# Altium project USB3-PCIEv21.PRJPCB
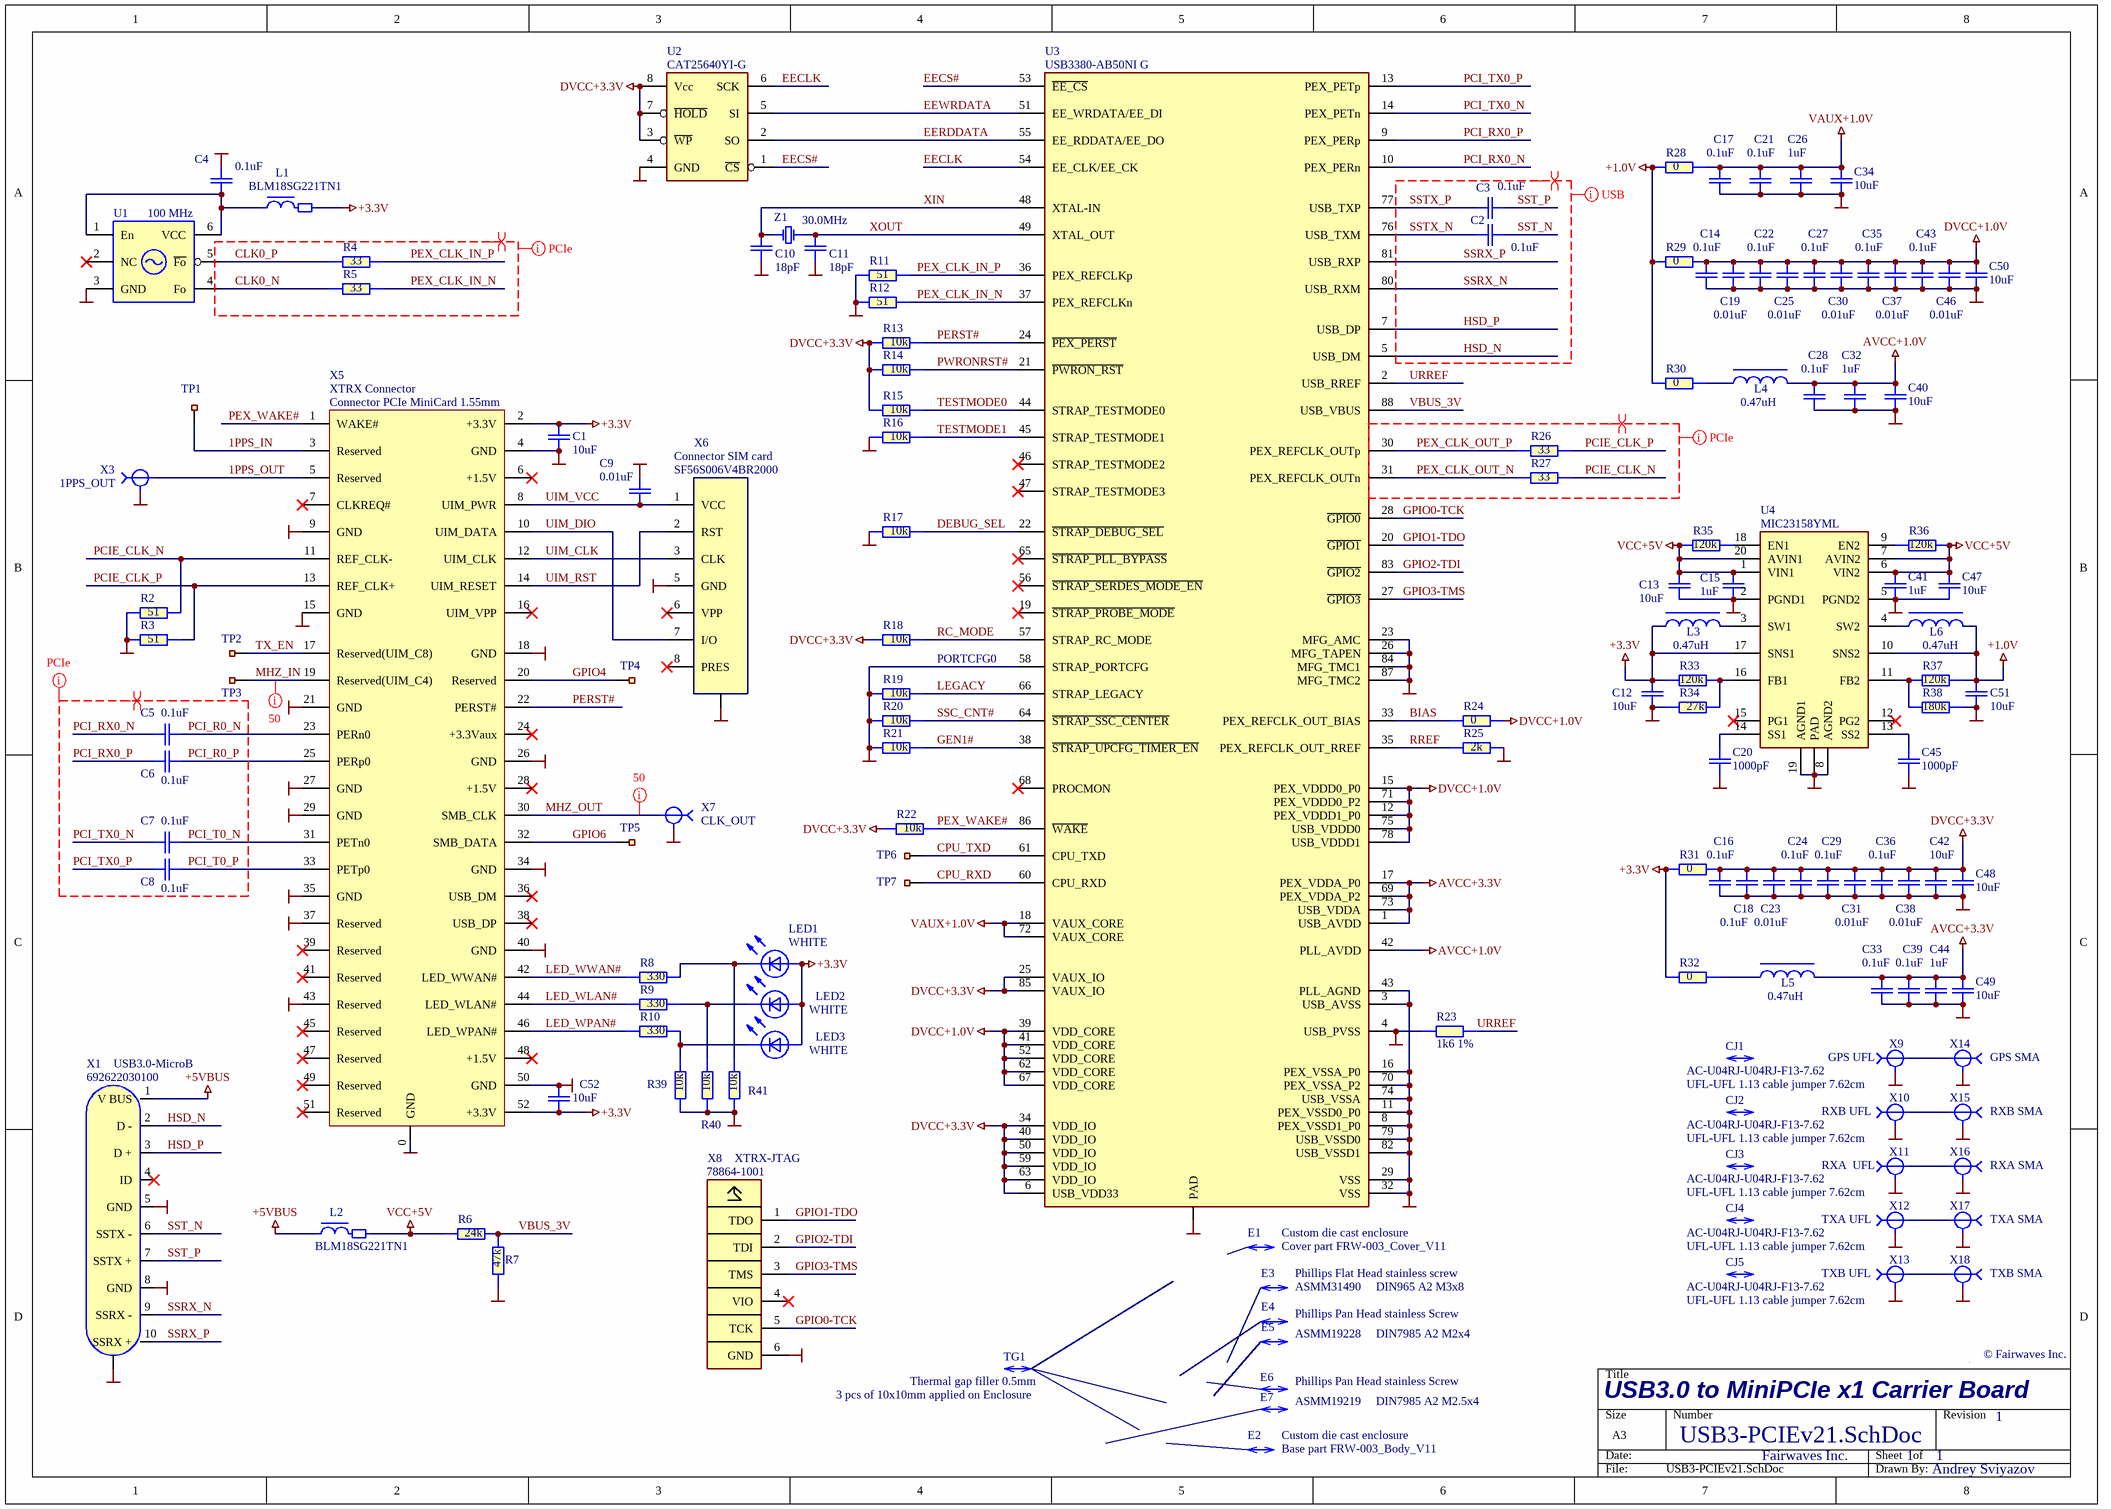
[diagram p0: USB3-PCIEv21.SchDoc]
1 sheet, 143 parts. Net scope: hierarchical (ports join the sheet entries above them; power ports are global).
Board file: USB3-PCIEv21.PcbDoc

## Sheet USB3-PCIEv21.SchDoc: USB3.0 to MiniPCIe x1 Carrier Board
size A3; CompanyName: Fairwaves Inc.; DrawnBy: Andrey Sviyazov; Revision: 1; SheetNumber: 1; SheetTotal: 1; PageSetup: Record=PageOptions|CenterHorizontal=True|CenterVertical=True|PrintScale=1.04|XCorrection=1.00|YCorrection=1.00|PrintKind=0|BorderSize=5000000|LeftOffset=0|BottomOffset=0|Orientation=2|PaperLength=1000|PaperWidth=1000|Scale=100|PaperSource=7|PrintQuality=-3|MediaType=1|DitherType=10|PrintScaleMode=1|PaperKind=A3|PaperIndex=8

### Parts
C1  10uF  [C0402-Phillips]
C2  0.1uF  [C0402-Phillips]
C3  0.1uF  [C0402-Phillips]
C4  0.1uF  [C0402-Phillips]
C5  0.1uF  [C0402-Phillips]
C6  0.1uF  [C0402-Phillips]
C7  0.1uF  [C0402-Phillips]
C8  0.1uF  [C0402-Phillips]
C9  0.01uF  [C0402-Phillips]
C10  18pF  [C0402-Phillips]
C11  18pF  [C0402-Phillips]
C12  10uF  [C0402-Phillips]
C13  10uF  [C0402-Phillips]
C14  0.1uF  [C0402-Phillips]
C15  1uF  [C0402-Phillips]
C16  0.1uF  [C0402-Phillips]
C17  0.1uF  [C0402-Phillips]
C18  0.1uF  [C0402-Phillips]
C19  0.01uF  [C0402-Phillips]
C20  1000pF  [C0402-Phillips]
C21  0.1uF  [C0402-Phillips]
C22  0.1uF  [C0402-Phillips]
C23  0.01uF  [C0402-Phillips]
C24  0.1uF  [C0402-Phillips]
C25  0.01uF  [C0402-Phillips]
C26  1uF  [C0402-Phillips]
C27  0.1uF  [C0402-Phillips]
C28  0.1uF  [C0402-Phillips]
C29  0.1uF  [C0402-Phillips]
C30  0.01uF  [C0402-Phillips]
C31  0.01uF  [C0402-Phillips]
C32  1uF  [C0402-Phillips]
C33  0.1uF  [C0402-Phillips]
C34  10uF  [C0402-Phillips]
C35  0.1uF  [C0402-Phillips]
C36  0.1uF  [C0402-Phillips]
C37  0.01uF  [C0402-Phillips]
C38  0.01uF  [C0402-Phillips]
C39  0.1uF  [C0402-Phillips]
C40  10uF  [C0402-Phillips]
C41  1uF  [C0402-Phillips]
C42  10uF  [C0402-Phillips]
C43  0.1uF  [C0402-Phillips]
C44  1uF  [C0402-Phillips]
C45  1000pF  [C0402-Phillips]
C46  0.01uF  [C0402-Phillips]
C47  10uF  [C0402-Phillips]
C48  10uF  [C0402-Phillips]
C49  10uF  [C0402-Phillips]
C50  10uF  [C0402-Phillips]
C51  10uF  [C0402-Phillips]
C52  10uF  [C0402-Phillips]
CJ1  AC-U04RJ-U04RJ-F13-7.62  Misc: UFL-UFL 1.13 cable jumper 7.62cm  (mechanical)
CJ2  AC-U04RJ-U04RJ-F13-7.62  Misc: UFL-UFL 1.13 cable jumper 7.62cm  (mechanical)
CJ3  AC-U04RJ-U04RJ-F13-7.62  Misc: UFL-UFL 1.13 cable jumper 7.62cm  (mechanical)
CJ4  AC-U04RJ-U04RJ-F13-7.62  Misc: UFL-UFL 1.13 cable jumper 7.62cm  (mechanical)
CJ5  AC-U04RJ-U04RJ-F13-7.62  Misc: UFL-UFL 1.13 cable jumper 7.62cm  (mechanical)
E1  Cover part FRW-003_Cover_V11  (mechanical)
E2  Base part FRW-003_Body_V11  (mechanical)
E3  DIN965 A2 M3x8  value ASMM31490  Misc: Phillips Flat Head stainless screw  (mechanical)
E4  DIN7985 A2 M2x4  value ASMM19228  Misc: Phillips Pan Head stainless Screw  (mechanical)
E5  DIN7985 A2 M2x4  (value not drawn)  (mechanical)
E6  DIN7985 A2 M2.5x4  value ASMM19219  Misc: Phillips Pan Head stainless Screw  (mechanical)
E7  DIN7985 A2 M2.5x4  (value not drawn)  (mechanical)
L1  BLM18SG221TN1  [TI160808-Phillips]
L2  BLM18SG221TN1  [TI160808-Phillips]
L3  0.47uH  [L-VLS201610HBX]
L4  0.47uH  [L-VLS201610HBX]
L5  0.47uH  [L-VLS201610HBX]
L6  0.47uH  [L-VLS201610HBX]
LED1  WHITE  [LED-0603YL]
LED2  WHITE  [LED-0603YL]
LED3  WHITE  [LED-0603YL]
LOGO1  © Fairwaves Inc.  [Logo Fairwaves]  (no BOM)
R2  51  [R0402-Phillips]
R3  51  [R0402-Phillips]
R4  33  [R0402-Phillips]
R5  33  [R0402-Phillips]
R6  24k  [R0402-Phillips]
R7  47k  [R0402-Phillips]
R8  330  [R0402-Phillips]
R9  330  [R0402-Phillips]
R10  330  [R0402-Phillips]
R11  51  [R0402-Phillips]
R12  51  [R0402-Phillips]
R13  10k  [R0402-Phillips]
R14  10k  [R0402-Phillips]
R15  10k  [R0402-Phillips]
R16  10k  [R0402-Phillips]
R17  10k  [R0402-Phillips]
R18  10k  [R0402-Phillips]
R19  10k  [R0402-Phillips]
R20  10k  [R0402-Phillips]
R21  10k  [R0402-Phillips]
R22  10k  [R0402-Phillips]
R23  1k6 1%  [R0402-Phillips]
R24  0  [R0402-Phillips]
R25  2k  [R0402-Phillips]
R26  33  [R0402-Phillips]
R27  33  [R0402-Phillips]
R28  0  [R0402-Phillips]
R29  0  [R0402-Phillips]
R30  0  [R0402-Phillips]
R31  0  [R0402-Phillips]
R32  0  [R0402-Phillips]
R33  120k  [R0402-Phillips]
R34  27k  [R0402-Phillips]
R35  120k  [R0402-Phillips]
R36  120k  [R0402-Phillips]
R37  120k  [R0402-Phillips]
R38  180k  [R0402-Phillips]
R39  10k  [R0402-Phillips]
R40  10k  [R0402-Phillips]
R41  10k  [R0402-Phillips]
TG1  3 pcs of 10x10mm applied on Enclosure  Misc: Thermal gap filler 0.5mm  (mechanical)
TP1  (no value)  [KP-C_d1mm]  (no BOM)
TP2  (no value)  [KP-C_d1mm]  (no BOM)
TP3  (no value)  [KP-C_d1mm]  (no BOM)
TP4  (no value)  [KP-C_d1mm]  (no BOM)
TP5  (no value)  [KP-C_d1mm]  (no BOM)
TP6  (no value)  [KP-C_d1mm]  (no BOM)
TP7  (no value)  [KP-C_d1mm]  (no BOM)
U1  100 MHz  [XO5X3.2-6pin]
U2  CAT25640YI-G  [TSSOP-8]
U3  USB3380-AB50NI G  [QFN-88(10x10/0.4mm)_pad]
U4  MIC23158YML  [MLF-20(3X4/0.5)MIC]
X1  692622030100  [USB3.0-MicroB SMT]
X3  Misc: 1PPS_OUT  [U_FL]  (hidden comment: 0734120110)
X5  Connector PCIe MiniCard 1.55mm  value XTRX Connector  [PCIe MiniCard 1.55mm conn]
X6  Connector SIM card  Name: SF56S006V4BR2000  [SIM_SF56S006V4BR2000-dig]
X7  Misc: CLK_OUT  [U_FL]  (hidden comment: 0734120110)
X8  XTRX-JTAG  Name: 78864-1001  [Molex 78864-1001]
X9  Misc: GPS UFL  [U_FL]  (hidden comment: 0734120110)
X10  Misc: RXB UFL  [U_FL]  (hidden comment: 0734120110)
X11  Misc: RXA  UFL  [U_FL]  (hidden comment: 0734120110)
X12  Misc: TXA UFL  [U_FL]  (hidden comment: 0734120110)
X13  Misc: TXB UFL  [U_FL]  (hidden comment: 0734120110)
X14  Misc: GPS SMA  [SMA - edge]  (hidden comment: SMA edge SMD mount)
X15  Misc: RXB SMA  [SMA - edge]  (hidden comment: SMA edge SMD mount)
X16  Misc: RXA SMA  [SMA - edge]  (hidden comment: SMA edge SMD mount)
X17  Misc: TXA SMA  [SMA - edge]  (hidden comment: SMA edge SMD mount)
X18  Misc: TXB SMA  [SMA - edge]  (hidden comment: SMA edge SMD mount)
Z1  30.0MHz  [ZQ_SMD2532]

### Nets
+1.0V: C51.2 L6.2 R28.2 R29.2 R30.2 R37.1 U4.10(SNS2)
+3.3V: C1.2 C12.2 C52.1 L1.2 L3.1 LED1.2(A) LED2.2(A) LED3.2(A) R31.2 R32.2 R33.2 U4.17(SNS1) X5.2(+3.3V) X5.52(+3.3V)
+5VBUS: L2.1 X1.1(V_BUS)
AVCC+1.0V: C28.1 C32.2 C40.2 L4.2 U3.42(PLL_AVDD)
AVCC+3.3V: C33.1 C39.1 C44.2 C49.2 L5.2 U3.1(USB_AVDD) U3.17(PEX_VDDA_P0) U3.69(PEX_VDDA_P2) U3.73(USB_VDDA)
DVCC+1.0V: C14.1 C19.2 C22.1 C25.2 C27.1 C30.2 C35.1 C37.2 C43.1 C46.2 C50.2 R24.1 R29.1 U3.12(PEX_VDDD1_P0) U3.15(PEX_VDDD0_P0) U3.39(VDD_CORE) U3.41(VDD_CORE) U3.52(VDD_CORE) U3.62(VDD_CORE) U3.67(VDD_CORE) U3.71(PEX_VDDD0_P2) U3.75(USB_VDDD0) U3.78(USB_VDDD1)
DVCC+3.3V: C16.1 C18.1 C23.2 C24.1 C29.1 C31.2 C36.1 C38.2 C42.2 C48.2 R13.2 R14.2 R15.2 R18.2 R22.2 R31.1 U2.3(~{WP}) U2.7(~{HOLD}) U2.8(Vcc) U3.6(USB_VDD33) U3.25(VAUX_IO) U3.34(VDD_IO) U3.40(VDD_IO) U3.50(VDD_IO) U3.59(VDD_IO) U3.63(VDD_IO) U3.85(VAUX_IO)
GND: C1.1 C4.1 C9.2 C10.1 C11.1 C12.1 C13.1 C14.2 C15.1 C16.2 C17.2 C18.2 C19.1 C20.1 C21.2 C22.2 C23.1 C24.2 C25.1 C26.1 C27.2 C28.2 C29.2 C30.1 C31.1 C32.1 C33.2 C34.1 C35.2 C36.2 C37.1 C38.1 C39.2 C40.1 C41.1 C42.1 C43.2 C44.1 C45.1 C46.1 C47.1 C48.1 C49.1 C50.1 C51.1 C52.2 R2.2 R3.2 R7.1 R11.2 R12.2 R16.2 R17.2 R19.2 R20.2 R21.2 R23.2 R25.1 R34.2 R38.1 R39.2 R40.2 R41.2 U1.3(GND) U2.4(GND) U3.0(PAD) U3.3(USB_AVSS) U3.4(USB_PVSS) U3.8(PEX_VSSD1_P0) U3.11(PEX_VSSD0_P0) U3.16(PEX_VSSA_P0) U3.23(MFG_AMC) U3.26(MFG_TAPEN) U3.29(VSS) U3.32(VSS) U3.43(PLL_AGND) U3.58(STRAP_PORTCFG) U3.70(PEX_VSSA_P2) U3.74(USB_VSSA) U3.79(USB_VSSD0) U3.82(USB_VSSD1) U3.84(MFG_TMC1) U3.87(MFG_TMC2) U4.0(PAD) U4.2(PGND1) U4.5(PGND2) U4.8(AGND2) U4.19(AGND1) X1.0(GND) X1.5(GND) X1.8(GND) X3.2(GND) X5.0(GND) X5.4(GND) X5.9(GND) X5.15(GND) X5.18(GND) X5.21(GND) X5.26(GND) X5.27(GND) X5.29(GND) X5.34(GND) X5.35(GND) X5.37(Reserved) X5.40(GND) X5.43(Reserved) X5.50(GND) X6.0(GND) X6.5(GND) X7.2(GND) X8.6(GND) X9.2(GND) X10.2(GND) X11.2(GND) X12.2(GND) X13.2(GND) X14.2(GND) X15.2(GND) X16.2(GND) X17.2(GND) X18.2(GND)
VAUX+1.0V: C17.1 C21.1 C26.2 C34.2 R28.1 U3.18(VAUX_CORE) U3.72(VAUX_CORE)
VCC+5V: C13.2 C15.2 C41.2 C47.2 L2.2 R6.2 R35.2 R36.1 U4.1(VIN1) U4.6(VIN2) U4.7(AVIN2) U4.20(AVIN1)
1PPS_IN: TP1.1 X5.3(Reserved)
1PPS_OUT: X3.1 X5.5(Reserved)
BIAS: R24.2 U3.33(PEX_REFCLK_OUT_BIAS)
CLK0_N: R5.2 U1.4(Fo)
CLK0_P: R4.2 U1.5(~{Fo})
CPU_RXD: TP7.1 U3.60(CPU_RXD)
CPU_TXD: TP6.1 U3.61(CPU_TXD)
DEBUG_SEL: R17.1 U3.22(~{STRAP_DEBUG_SEL})
EECLK: U2.6(SCK) U3.54(EE_CLK/EE_CK)
EECS#: U2.1(~{CS}) U3.53(~{EE_CS})
EERDDATA: U2.2(SO) U3.55(EE_RDDATA/EE_DO)
EEWRDATA: U2.5(SI) U3.51(EE_WRDATA/EE_DI)
GEN1#: R21.1 U3.38(~{STRAP_UPCFG_TIMER_EN})
GPIO0-TCK: U3.28(~{GPIO0}) X8.5(TCK)
GPIO1-TDO: U3.20(~{GPIO1}) X8.1(TDO)
GPIO2-TDI: U3.83(~{GPIO2}) X8.2(TDI)
GPIO3-TMS: U3.27(~{GPIO3}) X8.3(TMS)
GPIO4: TP4.1 X5.20(Reserved)
GPIO6: TP5.1 X5.32(SMB_DATA)
HSD_N: U3.5(USB_DM) X1.2(D_-)
HSD_P: U3.7(USB_DP) X1.3(D_+)
LED_WLAN#: R9.2 X5.44(LED_WLAN#)
LED_WPAN#: R10.2 X5.46(LED_WPAN#)
LED_WWAN#: R8.2 X5.42(LED_WWAN#)
LEGACY: R19.1 U3.66(STRAP_LEGACY)
MHZ_IN: TP3.1 X5.19(Reserved(UIM_C4))
MHZ_OUT: X5.30(SMB_CLK) X7.1
PCI_R0_N: C5.1 X5.23(PERn0)
PCI_R0_P: C6.1 X5.25(PERp0)
PCI_RX0_N: C5.2 U3.10(PEX_PERn)
PCI_RX0_P: C6.2 U3.9(PEX_PERp)
PCI_T0_N: C7.1 X5.31(PETn0)
PCI_T0_P: C8.1 X5.33(PETp0)
PCI_TX0_N: C7.2 U3.14(PEX_PETn)
PCI_TX0_P: C8.2 U3.13(PEX_PETp)
PCIE_CLK_N: R2.1 R27.1 X5.11(REF_CLK-)
PCIE_CLK_P: R3.1 R26.1 X5.13(REF_CLK+)
PERST#: R13.1 U3.24(~{PEX_PERST}) X5.22(PERST#)
PEX_CLK_IN_N: R5.1 R12.1 U3.37(PEX_REFCLKn)
PEX_CLK_IN_P: R4.1 R11.1 U3.36(PEX_REFCLKp)
PEX_CLK_OUT_N: R27.2 U3.31(PEX_REFCLK_OUTn)
PEX_CLK_OUT_P: R26.2 U3.30(PEX_REFCLK_OUTp)
PEX_WAKE#: R22.1 U3.86(~{WAKE}) X5.1(WAKE#)
PWRONRST#: R14.1 U3.21(~{PWRON_RST})
RC_MODE: R18.1 U3.57(STRAP_RC_MODE)
RREF: R25.2 U3.35(PEX_REFCLK_OUT_RREF)
SSC_CNT#: R20.1 U3.64(~{STRAP_SSC_CENTER})
SSRX_N: U3.80(USB_RXM) X1.9(SSRX_-)
SSRX_P: U3.81(USB_RXP) X1.10(SSRX_+)
SST_N: C2.2 X1.6(SSTX_-)
SST_P: C3.2 X1.7(SSTX_+)
SSTX_N: C2.1 U3.76(USB_TXM)
SSTX_P: C3.1 U3.77(USB_TXP)
TESTMODE0: R15.1 U3.44(STRAP_TESTMODE0)
TESTMODE1: R16.1 U3.45(STRAP_TESTMODE1)
TX_EN: TP2.1 X5.17(Reserved(UIM_C8))
UIM_CLK: X5.12(UIM_CLK) X6.3(CLK)
UIM_DIO: X5.10(UIM_DATA) X6.7(I/O)
UIM_RST: X5.14(UIM_RESET) X6.2(RST)
UIM_VCC: C9.1 X5.8(UIM_PWR) X6.1(VCC)
URREF: R23.1 U3.2(USB_RREF)
VBUS_3V: R6.1 R7.2 U3.88(USB_VBUS)
XIN: C10.2 U3.48(XTAL-IN) Z1.1
XOUT: C11.2 U3.49(XTAL_OUT) Z1.3
NetC4_2: C4.2 L1.1 U1.1(En) U1.6(VCC)
NetC20_2: C20.2 U4.14(SS1)
NetC45_2: C45.2 U4.13(SS2)
NetL3_2: L3.2 U4.3(SW1)
NetL4_1: L4.1 R30.1
NetL5_1: L5.1 R32.1
NetL6_1: L6.1 U4.4(SW2)
NetLED1_1: LED1.1(K) R8.1 R41.1
NetLED2_1: LED2.1(K) R9.1 R40.1
NetLED3_1: LED3.1(K) R10.1 R39.1
NetR33_1: R33.1 R34.1 U4.16(FB1)
NetR35_1: R35.1 U4.18(EN1)
NetR36_2: R36.2 U4.9(EN2)
NetR37_2: R37.2 R38.2 U4.11(FB2)
NetX9_1: X9.1 X14.1
NetX10_1: X10.1 X15.1
NetX11_1: X11.1 X16.1
NetX12_1: X12.1 X17.1
NetX13_1: X13.1 X18.1

Not connected (* = marked no-connect by the designer): CJ1 ?1; CJ2 ?1; CJ3 ?1; CJ4 ?1; CJ5 ?1; E1 ?1; E2 ?1; E3 ?1; E4 ?1; E5 ?1; E6 ?1; E7 ?1; LOGO1 1; TG1 ?1; U1 2(NC)*; U3 19(~{STRAP_PROBE_MODE})* 46(STRAP_TESTMODE2)* 47(STRAP_TESTMODE3)* 56(~{STRAP_SERDES_MODE_EN})* 65(~{STRAP_PLL_BYPASS})* 68(PROCMON)*; U4 12(PG2)* 15(PG1)*; X1 4(ID)*; X5 6(+1.5V)* 7(CLKREQ#)* 16(UIM_VPP)* 24(+3.3Vaux)* 28(+1.5V)* 36(USB_DM)* 38(USB_DP)* 39(Reserved)* 41(Reserved)* 45(Reserved)* 47(Reserved)* 48(+1.5V)* 49(Reserved)* 51(Reserved)*; X6 6(VPP)* 8(PRES)*; X8 4(VIO)*

### Layout directives
differential pair; Differential Pair Class: 100: CLK0_N, CLK0_P, PCI_R0_N, PCI_R0_P, PCI_RX0_N, PCI_RX0_P, PCI_T0_N, PCI_T0_P, PCI_TX0_N, PCI_TX0_P, PCIE_CLK_N, PCIE_CLK_P, PEX_CLK_IN_N, PEX_CLK_IN_P, PEX_CLK_OUT_N, PEX_CLK_OUT_P
net class 50: MHZ_IN, MHZ_OUT
net class PCIe: CLK0_N, CLK0_P, PCI_R0_N, PCI_R0_P, PCI_RX0_N, PCI_RX0_P, PCI_T0_N, PCI_T0_P, PCI_TX0_N, PCI_TX0_P, PCIE_CLK_N, PCIE_CLK_P, PEX_CLK_IN_N, PEX_CLK_IN_P, PEX_CLK_OUT_N, PEX_CLK_OUT_P
net class USB: HSD_N, HSD_P, SSRX_N, SSRX_P, SST_N, SST_P, SSTX_N, SSTX_P
differential pair; net class 90: HSD_N, HSD_P, SSRX_N, SSRX_P, SST_N, SST_P, SSTX_N, SSTX_P

### Notes on the sheet
- PORTCFG0

### Library data of the parts
C1 C12 C13 C34 C40 C42 C47-C52 = C0402: Capacitor; Manufacturer: MuRata; Tolerance: 20%; Name: SMD0402; U/P/TKE: X5R/6.3V; Value: 10uF; Link: https://octopart.com/search?q=0402%2010uF%206.3V&start=0
C2-C8 C14 C16-C18 C21 C22 C24 C27-C29 C33 C35 C36 C39 C43 = C0402: Capacitor; Manufacturer: YAGEO; Tolerance: 20%; Name: SMD0402; U/P/TKE: X5R/25V; Value: 0.1uF; Link: http://www.digikey.com/product-detail/en/CC0402KRX5R7BB104/311-1347-1-ND/2103131
C9 C19 C23 C25 C30 C31 C37 C38 C46 = C0402: Capacitor; Manufacturer: YAGEO; Tolerance: 20%; Name: SMD0402; U/P/TKE: X7R/10V; Value: 0.01uF; Link: https://octopart.com/search?q=CC0402%2010000pF%20X7R&start=0
C10 C11 = C0402: Capacitor; Manufacturer: Yageo; Tolerance: 10%; Name: SMD0402; U/P/TKE: C0G/10V; Value: 18pF; Link: https://octopart.com/search?q=CC0402%2018pF%20C0G%205%25&start=0
C15 C26 C32 C41 C44 = C0402: Capacitor; Manufacturer: MuRata; Tolerance: 20%; Name: SMD0402; U/P/TKE: X5R/10V; Value: 1uF; Link: https://octopart.com/grm155r61a105ke15d-murata-197442
C20 C45 = C0402: Capacitor; Manufacturer: MuRata; Tolerance: 20%; Name: SMD0402; U/P/TKE: X7R/50V; Value: 1000pF; Link: http://www.digikey.com/product-detail/en/GRM155R71H102KA01D/490-1303-2-ND/587225
CJ1-CJ5 = Mating part: Cable jumper; Manufacturer: RFSupplier; Name: AC-U04RJ-U04RJ-F13-7.62; Link: https://rfsupplier.com/customcable.html
E1 E2 = Mating subpart 1: Custom die cast enclosure; Link: https://drive.google.com/drive/u/0/folders/1I-mi6vT2nCMv3PGihUKQUKjrt9PQ-9GC; Misc: Custom die cast enclosure
  E1: Name: Cover part FRW-003_Cover_V11
  E2: Name: Base part FRW-003_Body_V11
E3 = Mating subpart 1: Screw M3; Manufacturer: Aspen Fasteners; Name: DIN965 A2 M3x8; Link: https://www.amazon.com/dp/B00BNCMRG4/ref=cm_sw_r_cp_ep_dp_6NDuBbRX0ZEC2
E4 = Mating subpart 1: Screw M2; Manufacturer: Aspen Fasteners; Name: DIN7985 A2 M2x4; Link: https://www.amazon.com/dp/B00BNCAFR2/ref=cm_sw_r_cp_ep_dp_pCFuBbPAM8QH4
E5 = Mating subpart 1: Screw M2; Manufacturer: Aspen Fasteners; Misc: Phillips Pan Head stainless Screw; Value: ASMM19228; Name: DIN7985 A2 M2x4; Link: https://www.amazon.com/dp/B00BNCAFR2/ref=cm_sw_r_cp_ep_dp_pCFuBbPAM8QH4
E6 = Mating subpart 1: Screw M2.5; Manufacturer: Aspen Fasteners; Name: DIN7985 A2 M2.5x4; Link: https://www.amazon.com/dp/B00BNC9YEM/ref=cm_sw_r_cp_ep_dp_pIFuBbHC3NF0M
E7 = Mating subpart 1: Screw M2.5; Manufacturer: Aspen Fasteners; Misc: Phillips Pan Head stainless Screw; Value: ASMM19219; Name: DIN7985 A2 M2.5x4; Link: https://www.amazon.com/dp/B00BNC9YEM/ref=cm_sw_r_cp_ep_dp_pIFuBbHC3NF0M
L1 L2 = TI160808: EMI ferrite bead; Manufacturer: MURATA; U/P/TKE: 2.5A/40mOhm; Value: 220; Name: BLM18SG221TN1; Link: https://octopart.com/blm18sg221tn1d-murata-7742616
L3-L6 = L-VLS20161xHBX-1: Coil; Manufacturer: TDK; U/P/TKE: 2.8A/35mOhm; Name: VLS201610HBX-R47M-1; Value: 0.47uH; Link: https://octopart.com/vls201610hbx-r47m-1-tdk-52458594
LED1-LED3 = LED0603GR_Lite-On: LED WHITE; Manufacturer: Lite-On Inc; Name: LTW-C190DA5; U/P/TKE: 100mcd, 2.7V/5mA, -30+85°C; Link: https://octopart.com/ltw-c190da5-lite-on-20324489?r=sp&s=07WAyZa6SYa5jtmHD_gN_Q; Value: WHITE
LOGO1 = Logo Fairwaves: Name: © Fairwaves Inc.; Misc: *
R2-R22 R24-R32 R39-R41 = R0402: Resistor; Manufacturer: BOURNS; Tolerance: 5%; Name: CR0402-JW; U/P/TKE: 50V/60mW/200ppm
  R2 R3 R11 R12: Value: 51
  R4 R5 R26 R27: Value: 33
  R6: Value: 24k
  R7: Value: 47k
  R8-R10: Value: 330
  R13-R22 R39-R41: Value: 10k
  R24 R28-R32: Value: 0
  R25: Value: 2k
R23 = R0402: Resistor; Manufacturer: BOURNS; Name: CR0402-JW; U/P/TKE: 50V/60mW/200ppm; Tolerance: 1%; Value: 1k6 1%
R33-R38 = R0402: Resistor; Manufacturer: BOURNS; Tolerance: 1%; Name: CR0402-JW; U/P/TKE: 50V/60mW/200ppm
  R33 R35-R37: Value: 120k
  R34: Value: 27k
  R38: Value: 180k
TG1 = Mating subpart 1: Thermal gap filler; Manufacturer: Wakefield; Name: PL-05-5-1016-H; Link: https://octopart.com/pl-05-5-1016-h-wakefield-80458840; Value: 3 pcs of 10x10mm applied on Enclosure
TP1-TP7 = KP40X40: Test point; Manufacturer: PCB
U1 = XO_5x3.2_6pin: Cristal Oscillator HSCL; Manufacturer: Abracon LLC; Name: ASFLMPHC-100.000MHZ-LR-T; U/P/TKE: 2.26~3.6V/HSCL/25ppm; Link: https://octopart.com/asflmphc-100.000mhz-lr-t-abracon-20254895?r=sp&s=Tmbu10t_QBWQQgEx7Dnw4A; Value: 100 MHz
U2 = CAT25640: IC SPI CMOS EEPROM; Manufacturer: ON Semi; Value: 64kbit; Name: CAT25640YI-G; Link: https://octopart.com/cat25640yi-g-on+semiconductor-13132660?r=sp&s=sj-Wom8UQsSSkL3DnHra1A
U3 = USB3380: IC; Manufacturer: PLX Tech; Misc: PCIe gen 2 to USB 3.0 controller; Link: https://octopart.com/usb3380-ab50ni+g-avago-51854480; Name: USB3380-AB50NI G
U4 = MIC23158_9: IC dual 2A step down DCDC; Manufacturer: MIcrochip; Swap: No; U/P/TKE: 2.7-5.5V to 1.0-3.3V/2A; Name: MIC23158YML; Link: https://octopart.com/mic23158yml-t5-microchip-66800781?r=sp&s=2B-5sdHiQDiFSNDW-gVygQ
X1 = USB3.0-MicroB: Connector microUSB3.0-Type B; Manufacturer: Wurth; Link: https://octopart.com/692622030100-w%C3%BCrth+elektronik-19667821; Value: 692622030100; Name: USB3.0-MicroB
X3 X7 X9-X13 = U_FL: Connector (UMCC); Manufacturer: Molex; Name: 0734120110; Link: https://octopart.com/0734120110-molex-16756629
X5 = PCIe MiniCard conn h1.55mm: Manufacturer: JAE Electronics; Name: MM60-52B1-G1; Link: https://octopart.com/mm60-52b1-g1-r850-jae+electronics-19499790
X6 = SIM micro push-push: Manufacturer: JAE; Link: https://octopart.com/sf56s006v4br2000-jae+electronics-55772495; Volume: SIM micro push-push
X8 = Conn Molex_788641001: Connector board to board; Manufacturer: Molex; Misc: Connector board to board, 6 spring contacts; Value: XTRX-JTAG; Link: https://octopart.com/78864-1001-molex-52668680?r=sp&s=CalIQCkHRmWKRIBINWJXJg
X14-X18 = SMA EDGE SMD: Connector coaxial; Manufacturer: RFSupplier; Value: S01-SJEDM-11BS00; Name: SMA edge SMD mount; Link: https://rfsupplier.com/sma-jack-female-connector-straight-solder_p3413.html
Z1 = ZQ2.5x3.2-SMD: Quartz crystall SMD; Manufacturer: Abracon; Name: ABM8G-30.000MHZ-18-D2Y-T; U/P/TKE: -40+85C/<100ppm; Value: 30.0MHz; Link: https://octopart.com/abm8g-30.000mhz-18-d2y-t-abracon-12676610

## Assembly variants
Var_1: not fitted C4 L1 R2 R3 R4 R5 R11 R12 U1